# EAGLE design 3DR-Radio-915-v13(site) (EAGLE 6.2)
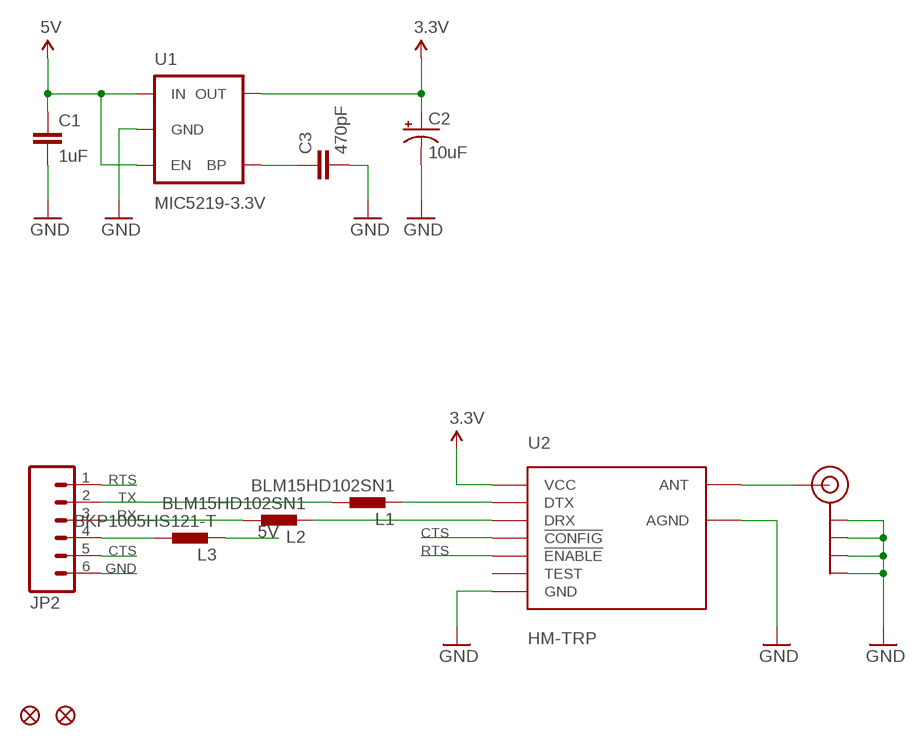
[diagram p0: schematic, sheet 1]

## Parts
C1  1uF  CAP0402-CAP  [0402-CAP]
C2  10uF  CAP_POL1206  [EIA3216]
C3  470pF  CAP0402-CAP  [0402-CAP]
J$2  SMA_EDGE  [SMA-EDGE]
JP1  FIDUCIAL1X2  [FIDUCIAL-1X2]
JP2  M06SIP  [1X06]
JP3  FIDUCIAL1X2  [FIDUCIAL-1X2]
L1  BLM15HD102SN1  INDUCTOR-0402  [0402-IND]
L2  BLM15HD102SN1  INDUCTOR-0402  [0402-IND]
L3  BKP1005HS121-T  INDUCTOR-0402  [0402-IND]
U1  MIC5219-3.3V  V_REG_LDOSMD  [SOT23-5]
U2  HM-TRP  HM-TRPSMD  [HM-TRP-SMD]

## Nets
3.3V [power]: C2.A(+) U1.5(OUT) U2.VCC
5V [power]: C1.1 L3.P$2 U1.1(IN) U1.3(EN)
CTS: JP2.5 U2.!CONFIG
GND [power]: C1.2 C2.C(-) C3.2 J$2.GND@0(GND) J$2.GND@1(GND) J$2.GND@2(GND) J$2.GND@3(GND) JP2.6 U1.2(GND) U2.AGND U2.GND
N$1: L1.P$2 U2.DTX
N$2: L2.P$2 U2.DRX
N$3: JP2.4 L3.P$1
N$8: J$2.SIG(SIGNAL) U2.ANT
N$13: C3.1 U1.4(BP)
RTS: JP2.1 U2.!ENABLE
RX: JP2.3 L2.P$1
TX: JP2.2 L1.P$1
Unconnected: U2.TEST

## Library data of the parts
C1 C3 = SparkFun:CAP: Capacitor Standard 0603 ceramic capacitor, and 0.1" leaded capacitor.
C2 = SparkFun:CAP_POL: Capacitor Polarized These are standard SMD and PTH capacitors. Normally 10uF, 47uF, and 100uF in electrolytic and tantalum varieties. Always verify the external diameter of the through hole cap, it varies with capacity, voltage, and manufacturer. The EIA devices should be standard.
J$2 = 3DRobotics:SMA_EDGE: SMA Antenna Connector End launch SMA connector. The paste layer has been removed so that the connector can be hand soldered onto the board after reflow.
JP1 JP3 = SparkFun:FIDUCIAL: Fiducial Alignment Points Various fiducial points for machine vision alignment.
JP2 = SparkFun:M06: Header 6 Standard 6-pin 0.1" header. Use with straight break away headers (SKU : PRT-00116), right angle break away headers (PRT-00553), swiss pins (PRT-00743), machine pins (PRT-00117), and female headers (PRT-00115). Molex polarized connector foot print use with SKU : PRT-08094 with associated crimp pins and housings. NOTES ON THE VARIANTS LOCK and LOCK_LONGPADS... This footprint was designed to help hold the alignment of a through-hole component (i.e. 6-pin header) while soldering it into place. You may notice that each hole has been shifted either up or down by 0.005 of an inch from it's more standard position (which is a perfectly straight line). This slight alteration caused the pins (the squares in the middle) to touch the edges of the holes. Because they are alternating, it causes a "brace" to hold the component in place. 0.005 has proven to be the perfect amount of "off-center" position when using our standard breakaway headers. Although looks a little odd when you look at the bare footprint, once you have a header in there, the alteration is very hard to notice. Also, if you push a header all the way into place, it is covered up entirely on the bottom side. This idea of altering the position of holes to aid alignment will be further integrated into the Sparkfun Library for other footprints. It can help hold any component with 3 or more connection pins.
L1-L3 = pel_dipol_comp:INDUCTOR
U1 = SparkFun:V_REG_LDO: Voltage Regulator LDO Standard 150mA LDO voltage regulator in SOT-23 layout. Micrel part MIC5205. BP (by-pass) pin is used to lower output noise with 470pF cap.
U2 = 3DRobotics:HM-TRP: HM-TRP Series 100mW Transceiver module HM-TRP series is a low cost, high performance transparent FSK transceiver with operating at 433/470/868/915 MHz. It features small size, high output power, high sensitivity, long transmission distance and high communication data rate with auto set up for communication change and data receiving and transmission control. There is UART interface, it is easy to realize the wireless data transmission with only providing the UART data. It is flexible for the users to set the UART baud rate, frequency, output power, data rate, frequency deviation, receiving bandwidth etc parameters. It is your ideal choice for designing wireless data transmission products which can be widely used on wireless data transmission field.

## Net classes
0 default: width 0.254 mm
1 power: width 0.508 mm

## Board
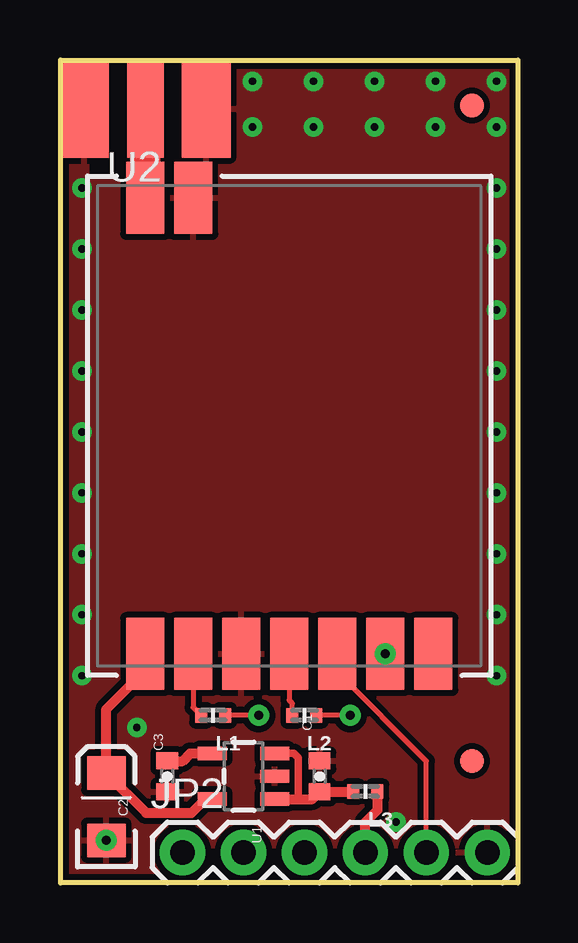
[diagram p1: board, top side]
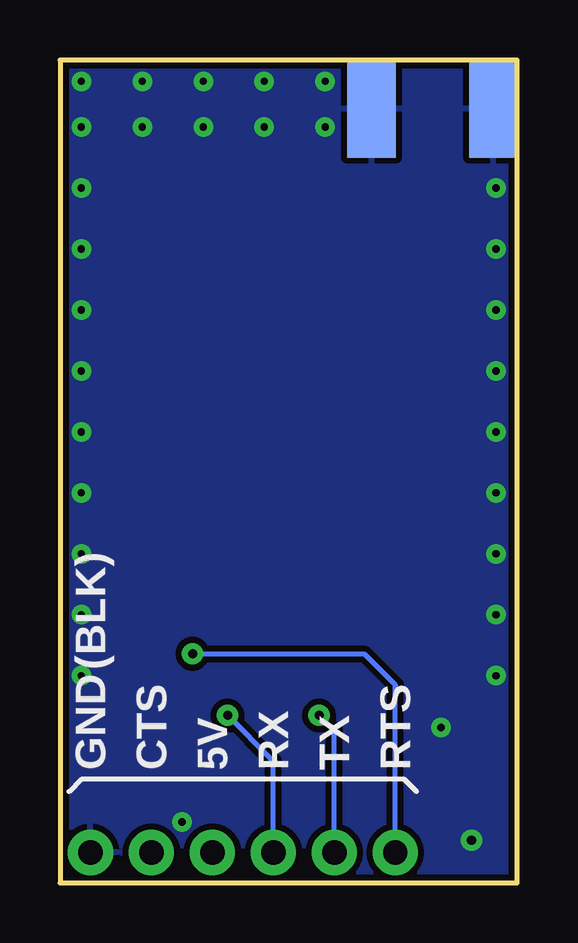
[diagram p2: board, bottom side, seen from below]

Size 19.05 x 34.29 mm. Coordinates in mm from the lower left corner, seen from the top.
Outline: 0,0 0,34.29 19.05,34.29 19.05,0 0,0
Copper layers (1*16): Top 0.035mm / dielectric 1.5mm / Bottom 0.035mm
Design rules: minimum track width 8mil, minimum drill 20mil, track to track 8mil, track to pad 8mil, pad to pad 8mil, via to via 8mil, smd to smd 8mil, copper to edge 10mil, drill to drill 8mil, minimum pad ring 12mil, minimum via ring 10mil, stop-mask expansion 4mil, vias tented up to drill 25mil, thermal gap 10mil

### Footprints (pad centres in the part's own frame; a part is rotated, then mirrored left to right if it is on the bottom)
0402-CAP = smd 0.7 x 0.9: 1 -0.65,0; 2 0.65,0
EIA3216 = smd 1.4 x 1.6: A 1.4,0; C -1.4,0
SMA-EDGE = smd 2.032 x 4.064: GND@0 -2.54,0; GND@1 2.54,0 | smd 2.032 x 4.064 bottom: GND@2 -2.54,0; GND@3 2.54,0 | smd 1.524 x 4.064: SIG 0,0
FIDUCIAL-1X2 = smd 1 x 1: 1 0,0
1X06 = drill 1.016 pad 1.88: 1 0,0; 2 2.54,0; 3 5.08,0; 4 7.62,0; 5 10.16,0; 6 12.7,0
0402-IND = smd 0.5 x 0.6: P$1 -0.5,0; P$2 0.5,0
SOT23-5 = smd 0.55 x 1.2: 1 -0.95,-1.3; 2 0,-1.3; 3 0.95,-1.3; 4 0.95,1.3; 5 -0.95,1.3
HM-TRP-SMD = smd 1.6 x 3: !CONFIG 2,-9.5; !ENABLE 4,-9.5; AGND -4,9.5; ANT -6,9.5; DRX 0,-9.5; DTX -4,-9.5; GND -2,-9.5; TEST 6,-9.5; VCC -6,-9.5

### Placement (x,y rotation side)
C1  10.79,4.45 90 top
C2  1.91,3.17 90 top
C3  4.45,4.45 270 top
J$2  3.53,32.26 0 top
JP1  17.14,32.38 0 top
JP2  5.08,1.27 0 top
JP3  17.14,5.08 0 top
L1  6.35,6.99 180 top
L2  10.16,6.99 180 top
L3  12.7,3.81 180 top
U1  7.62,4.45 90 top
U2  9.53,19.05 0 top

### Tracks (layer width: path | path; a pad name or v marks a point on that pad's centre or on a via)
3.3V
  Top 0.406: U2.VCC 3.56,9.52 3.56,8.89 1.91,7.24 C2.A 3.56,2.92 5.46,2.92 6.04,3.5 U1.5
5V
  Top 0.305: U1.3 9.72,5.39 9.91,5.21 9.91,3.5
  Top 0.406: L3.P$2 10.81,3.81 C1.1 10.49,3.5 9.91,3.5 U1.1
CTS
  Top 0.203: 11.43,10.16 11.53,10.06 U2.!CONFIG 11.53,8.79 15.24,5.08 JP2.5
GND  (via drill 0.3, 0.38)
  other vias: 1.91,1.78 3.17,6.48 13.97,2.54 18.16,33.4 15.62,33.4 13.08,33.4 10.54,33.4 8,33.4 18.16,31.5 18.16,28.96 18.16,26.42 18.16,23.88 18.16,21.34 18.16,18.8 18.16,16.26 18.16,13.72 18.16,11.18 18.16,8.64 0.89,28.96 0.89,26.42 0.89,23.88 0.89,21.34 0.89,18.8 0.89,16.26 0.89,13.72 0.89,11.18 0.89,8.64 15.62,31.5 13.08,31.5 10.54,31.5 8,31.5
  pour Bottom (isolate 0.254): 0,0 0,36.83 19.05,36.83 19.05,0
  pour Top (isolate 0.254): 0,0 0,29.21 19.05,29.21 19.05,0
  pour Top (isolate 0.254): 5.97,29.21 5.97,35.56 19.05,35.56 19.05,29.21
  pour Top (isolate 0.254): 0,29.21 0,35.56 1.09,35.56 1.09,29.21
N$1
  Top 0.203: U2.DTX 5.52,7.31 L1.P$2
N$2
  Top 0.203: U2.DRX 9.53,7.62 9.66,7.49 L2.P$2
N$3
  Top 0.406: JP2.4 12.7,2.54 13.2,3.04 L3.P$1
N$8
  Top 1.27: J$2.SIG U2.ANT
N$13
  Top 0.406: U1.4 5.39,5.39 5.08,5.08 4.46,5.08 C3.1
RTS  (via drill 0.38)
  Top 0.203: U2.!ENABLE 13.53,9.97 13.34,10.16
  Bottom 0.203: JP2.1 5.08,8.26 6.35,9.53 13.5,9.53 U2.!ENABLE
  other vias: 13.53,9.55
RX  (via drill 0.38)
  Top 0.203: v12.06,6.99 L2.P$1
  Bottom 0.203: v12.06,6.99 10.16,5.08 JP2.3
TX  (via drill 0.38)
  Top 0.203: v8.26,6.99 L1.P$1
  Bottom 0.203: v8.26,6.99 7.62,6.35 JP2.2

### Text on the board
bPlace: (BLK) | RTS | TX | RX | 5V | CTS | GND